# Altium schematic sheet MainBoard_MCU_PWR_Matt.SchDoc
size B
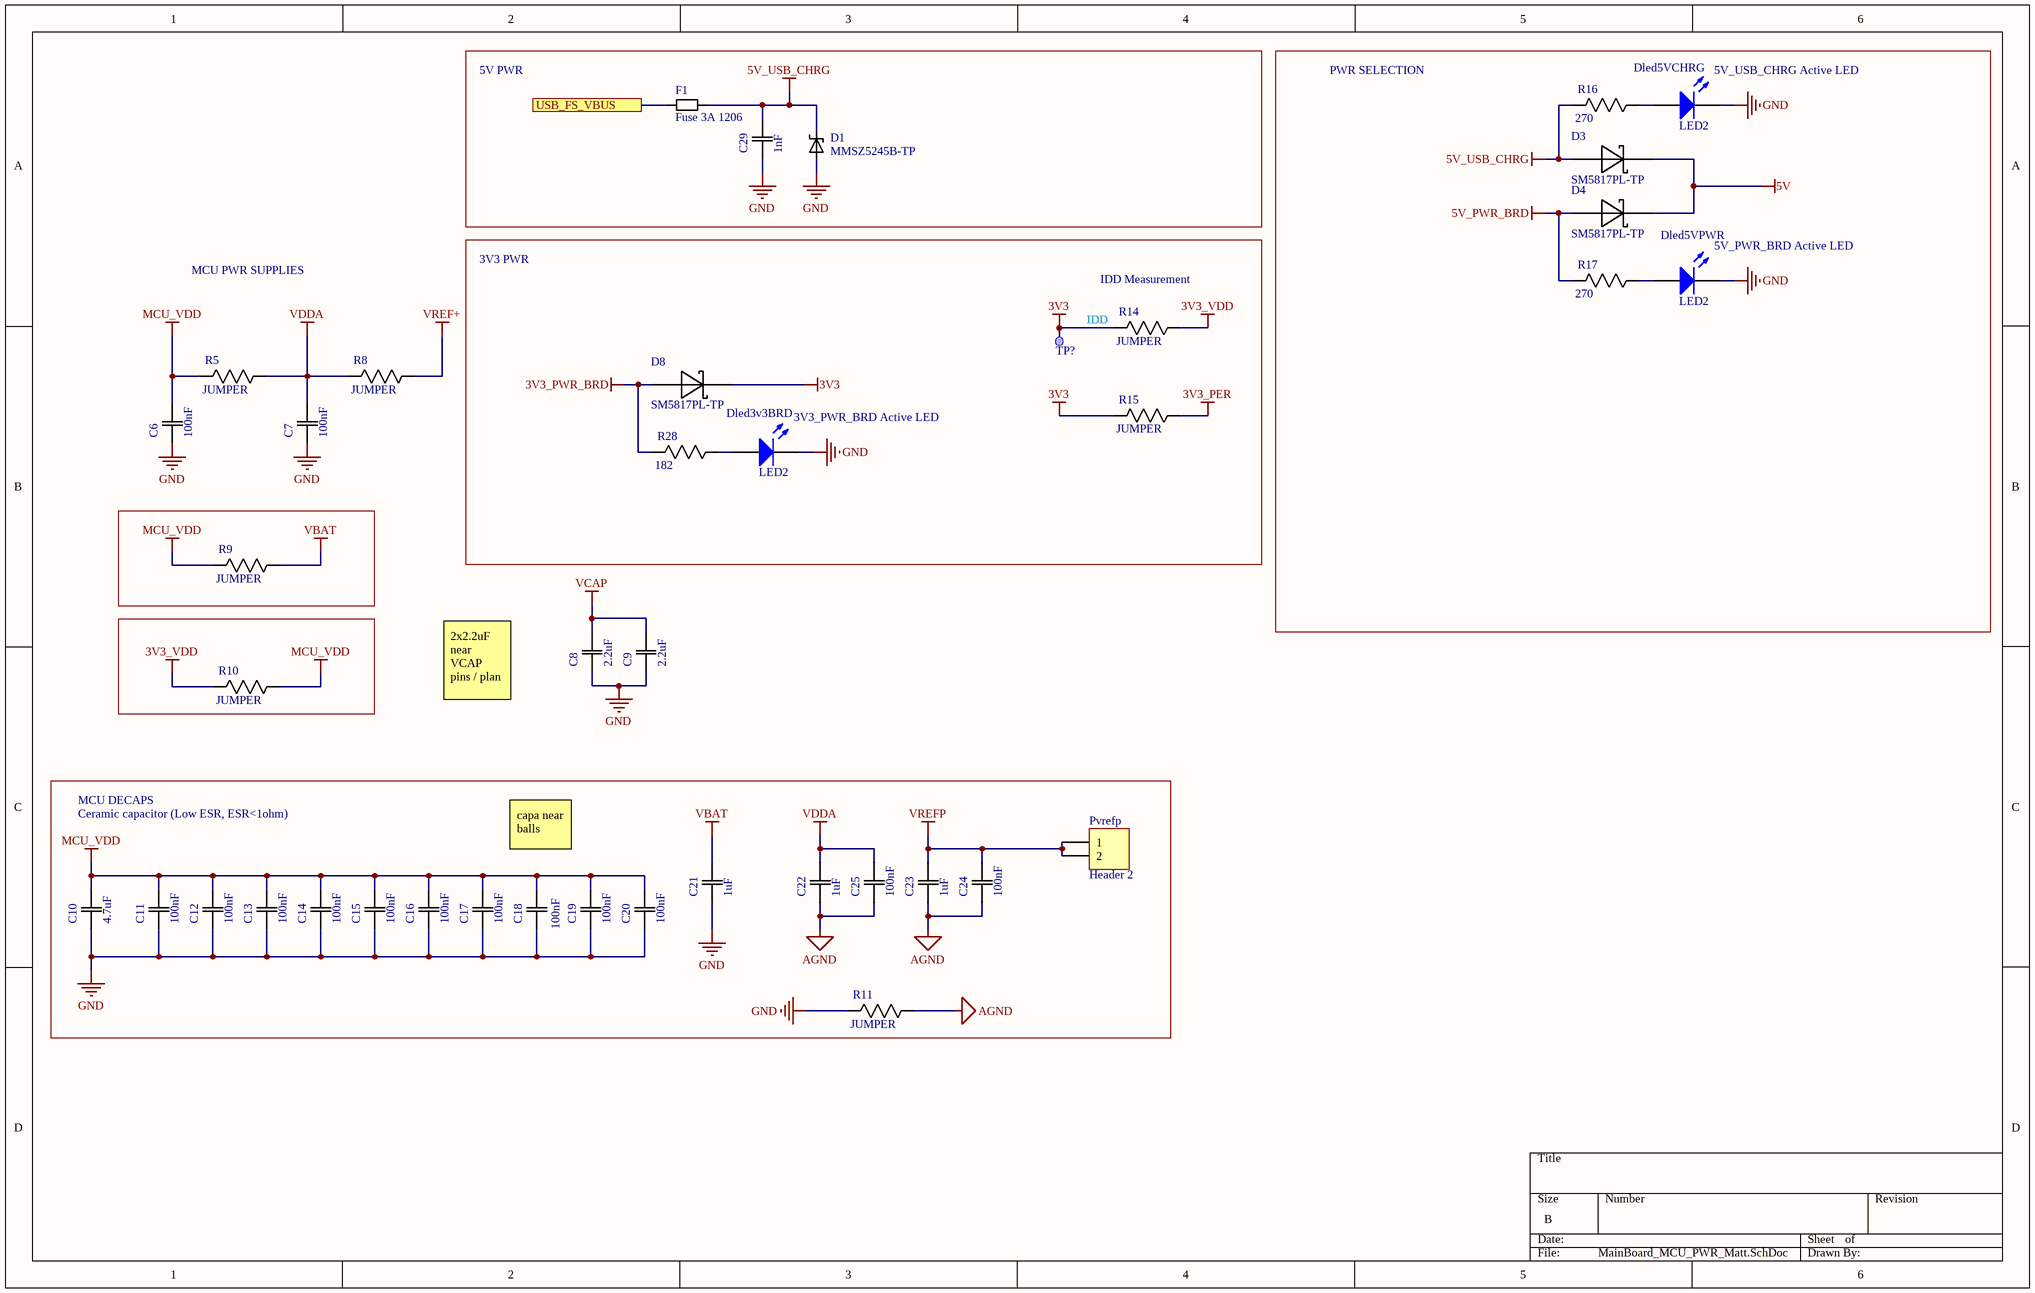
[diagram p0: MainBoard_MCU_PWR_Matt.SchDoc]

## Parts
C6  100nF  [0805]
C7  100nF  [0805]
C8  2.2uF  [0805]
C9  2.2uF  [0805]
C10  4.7uF  [0805]
C11  100nF  [0805]
C12  100nF  [0805]
C13  100nF  [0805]
C14  100nF  [0805]
C15  100nF  [0805]
C16  100nF  [0805]
C17  100nF  [0805]
C18  100nF  [0805]
C19  100nF  [0805]
C20  100nF  [0805]
C21  1uF  [0805]
C22  1uF  [0805]
C23  1uF  [0805]
C24  100nF  [0805]
C25  100nF  [0805]
C29  1nF  [0805]
D1  MMSZ5245B-TP  [SOD-123]
D3  SM5817PL-TP  [SOD-123]
D4  SM5817PL-TP  [SOD-123]
D8  SM5817PL-TP  [SOD-123]
Dled3v3BRD  LED2  [3.2X1.6X1.1]
Dled5VCHRG  LED2  [3.2X1.6X1.1]
Dled5VPWR  LED2  [3.2X1.6X1.1]
F1  Fuse 3A 1206  [1206]
Pvrefp  Header 2  [HDR1X2]
R5  JUMPER  [0805]
R8  JUMPER  [0805]
R9  JUMPER  [0805]
R10  JUMPER  [0805]
R11  JUMPER  [0805]
R14  JUMPER  [0805]
R15  JUMPER  [0805]
R16  270  [0805]
R17  270  [0805]
R28  182  [0805]
TP?  Test Point  [TP_SMD_1MM]  (value not drawn)  (no BOM)

## Blocks framed on the sheet
5V PWR: C29 D1 F1

## Ports
USB_FS_VBUS

## Nets
3V3: D8.C(K) R14.2(R2) R15.2(R2) TP?.1
3V3_PER: R15.1(R1)
3V3_PWR_BRD: D8.A R28.2(R2)
3V3_VDD: R10.2(R2) R14.1(R1)
5V: D3.C(K) D4.C(K)
5V_PWR_BRD: D4.A R17.2(R2)
5V_USB_CHRG: C29.2(C2) D1.C D3.A F1.2 R16.2(R2)
AGND: C22.1(C1) C23.1(C1) C24.1(C1) C25.1(C1) R11.1(R1)
GND: C6.1(C1) C7.1(C1) C8.1(C1) C9.1(C1) C10.1(C1) C11.1(C1) C12.1(C1) C13.1(C1) C14.1(C1) C15.1(C1) C16.1(C1) C17.1(C1) C18.1(C1) C19.1(C1) C20.1(C1) C21.1(C1) C29.1(C1) D1.A Dled3v3BRD.2(K) Dled5VCHRG.2(K) Dled5VPWR.2(K) R11.2(R2)
MCU_VDD: C6.2(C2) C10.2(C2) C11.2(C2) C12.2(C2) C13.2(C2) C14.2(C2) C15.2(C2) C16.2(C2) C17.2(C2) C18.2(C2) C19.2(C2) C20.2(C2) R5.2(R2) R9.2(R2) R10.1(R1)
VBAT: C21.2(C2) R9.1(R1)
VCAP: C8.2(C2) C9.2(C2)
VDDA: C7.2(C2) C22.2(C2) C25.2(C2) R5.1(R1) R8.2(R2)
VREF+: R8.1(R1)
VREFP: C23.2(C2) C24.2(C2) Pvrefp.1 Pvrefp.2
USB_FS_VBUS: F1.1 ; port USB_FS_VBUS
NetDled3v3BRD_1: Dled3v3BRD.1(A) R28.1(R1)
NetDled5VCHRG_1: Dled5VCHRG.1(A) R16.1(R1)
NetDled5VPWR_1: Dled5VPWR.1(A) R17.1(R1)

## Notes on the sheet
- PWR SELECTION
- (near Dled5VCHRG) 5V_USB_CHRG Active LED
- MCU PWR SUPPLIES
- 3V3 PWR
- (near R14) IDD Measurement
- (near Dled5VPWR) 5V_PWR_BRD Active LED
- IDD
- (near Dled3v3BRD) 3V3_PWR_BRD Active LED
- 2x2.2uF near VCAP pins / plan
- MCU DECAPS
- Ceramic capacitor (Low ESR, ESR<1ohm)
- capa near balls

## Library data of the parts
C6 C7 C11-C20 C24 C25 = CAP 100nF 0805: CAP CER 0.1UF 50V X7R 0805; MP: CC0805KRX7R9BB104; MF: Yageo; Tolerance: 10%; Package: 0805; Price: 0,119 CAD; Value: 100nF; Digikey: 311-1140-1-ND; Digikey Link: https://www.digikey.ca/products/en?keywords=311-1140-1-ND; Rating: 50V
C8 C9 = CAP 2.2uF 0805: CAP CER 1UF 50V X7R 0805; MP: C0805C225K4RACTU; MF: KEMET; Tolerance: 10%; Rating: 16V; Package: 0805; Price: 0,461 CAD; Value: 2.2uF; Digikey: 399-3523-1-ND; Digikey Link: https://www.digikey.ca/products/en?keywords=399-3523-1-ND
C10 = CAP 4.7uF 0805: CAP CER 4.7UF 25V X5R 0805; MP: CL21B475KOFNNNE; MF: Samsung Electro-Mechanics; Tolerance: 10%; Rating: 16V; Temperature Coefficient: X7R; Package: 0805; Price: 0,49 CAD; Value: 4.7uF; Digikey: 1276-2873-1-ND; Digikey Link: https://www.digikey.ca/product-detail/en/samsung-electro-mechanics/CL21B475KOFNNNE/1276-2873-1-ND/3890959
C21-C23 = CAP 1uF 0805: CAP CER 1UF 50V X7R 0805; MP: CL21B105KBFNNNE; MF: Samsung Electro-Mechanics; Tolerance: 10%; Package: 0805; Price: 0,172 CAD; Value: 1uF; Digikey: 1276-1029-1-ND; Digikey Link: https://www.digikey.ca/product-detail/en/samsung-electro-mechanics/CL21B105KBFNNNE/1276-1029-1-ND/3889115; Rating: 50V
C29 = CAP 1nF 0805: CAP CER 1000PF 50V X7R 0805; MP: CC0805KRX7R9BB102; MF: Yageo; Tolerance: 10%; Package: 0805; Price: 0.1 CAD; Value: 1nF; Digikey: 311-1127-1-ND; Digikey Link: https://www.digikey.ca/products/en?keywords=311-1127-1-ND; Rating: 50V
D1 = MMSZ5245B-TP: Zener Diode 15V 500mW ±5% Surface Mount SOD-123; MP: MMSZ5224BT1G; MF: ON Semiconductor; Price: None; SnapEDA_Link: https://www.snapeda.com/parts/MMSZ5224BT1G/ON%20Semiconductor/view-part/230941/?ref=snap; Package: SOD-123 ON Semiconductor; Availability: Unavailable; Value: *; ComponentLink1Description: digikey; ComponentLink1URL: https://www.digikey.ca/en/products/detail/micro-commercial-co/MMSZ5245B-TP/1793206
D3 D4 D8 = SM5817PL-TP: Diode Schottky 20V 1A Surface Mount SOD-123FL; MF: Micro Commercial Co; ComponentLink1Description: digikey; ComponentLink1URL: https://www.digikey.ca/product-detail/en/on-semiconductor/MBR0540T1G/MBR0540T1GOSCT-ND/917967; Digikey: SM5817PL-TPMSCT-ND; Digikey Link: https://www.digikey.ca/product-detail/en/micro-commercial-co/SM5817PL-TP/SM5817PL-TPMSCT-ND/1793410; MP: SM5817PL-TP; Voltage Rating: 20V; Package: SOD-123; Current Rating: 1A
Dled3v3BRD Dled5VCHRG Dled5VPWR = LED GREEN SMD: Typical RED, GREEN, YELLOW, AMBER GaAs LED; MF: Lite-On Inc.; MP: LTST-C191KGKT; Rating: 2V; Digikey: 160-1446-1-ND; Digikey Link: https://www.digikey.ca/products/en?keywords=160-1446-1-ND; Package: 0603
F1 = Fuse 3A 1206: FUSE 3.0A 63VAC/DC SLOW 1206; MF: Bel Fuse Inc.; MP: 0685T3000-01; Digikey: 507-1896-6-ND; Rating: 3A; Digikey Link: https://www.digikey.ca/product-detail/en/bel-fuse-inc/0685T3000-01/507-1896-6-ND/4968212
Pvrefp = Header 2: Header, 2-Pin; LatestRevisionDate: 17-Jul-2002; LatestRevisionNote: Re-released for DXP Platform.; Publisher: Altium Limited
R5 R8-R11 R14 R15 = RES 0 0805: RES SMD 0 OHM JUMPER 1/8W 0805; MP: RC0805JR-070RL; MF: Yageo; Value: 0; Rating: 0.125W; Digikey: 311-0.0ARCT-ND; Price: 0.058 CAD; Package: 0805; Digikey Link: https://www.digikey.ca/products/en?keywords=311-0.0ARCT-ND
R16 R17 = RES 270 0805: RES SMD 270 OHM 5% 1/8W 0805; MP: RC0805JR-07270RL; MF: Yageo; Rating: 0.125W; Digikey: 311-270ARCT-ND; Price: 0.054 CAD; Package: 0805; Value: 270; Digikey Link: https://www.digikey.ca/product-detail/en/yageo/RC0805JR-07270RL/311-270ARCT-ND/731238
R28 = RES 182 0805: RES SMD 182 OHM 1% 1/8W 0805; MP: ERJ-6ENF1820V; MF: Panasonic Electronic Components; Rating: 0.125W; Digikey: P182CCT-ND; Price: 0.15 CAD; Package: 0805; Value: 182; Digikey Link: https://www.digikey.ca/product-detail/en/panasonic-electronic-components/ERJ-6ENF1820V/P182CCT-ND/118743; Tolerance: 1%
TP? = MCD-00074: Test Point 1mm; Part_Type: Mechanical; Internal_Part_Number: MCD-00074; Provided_By: n/a; Status: Released; ComponentLink1Description: Datasheet; ComponentLink1URL: http://na; Manufacturer: n/a; Manufacturer_Part_Number: n/a; ECCN_US: n/a; ECCN_EU: n/a